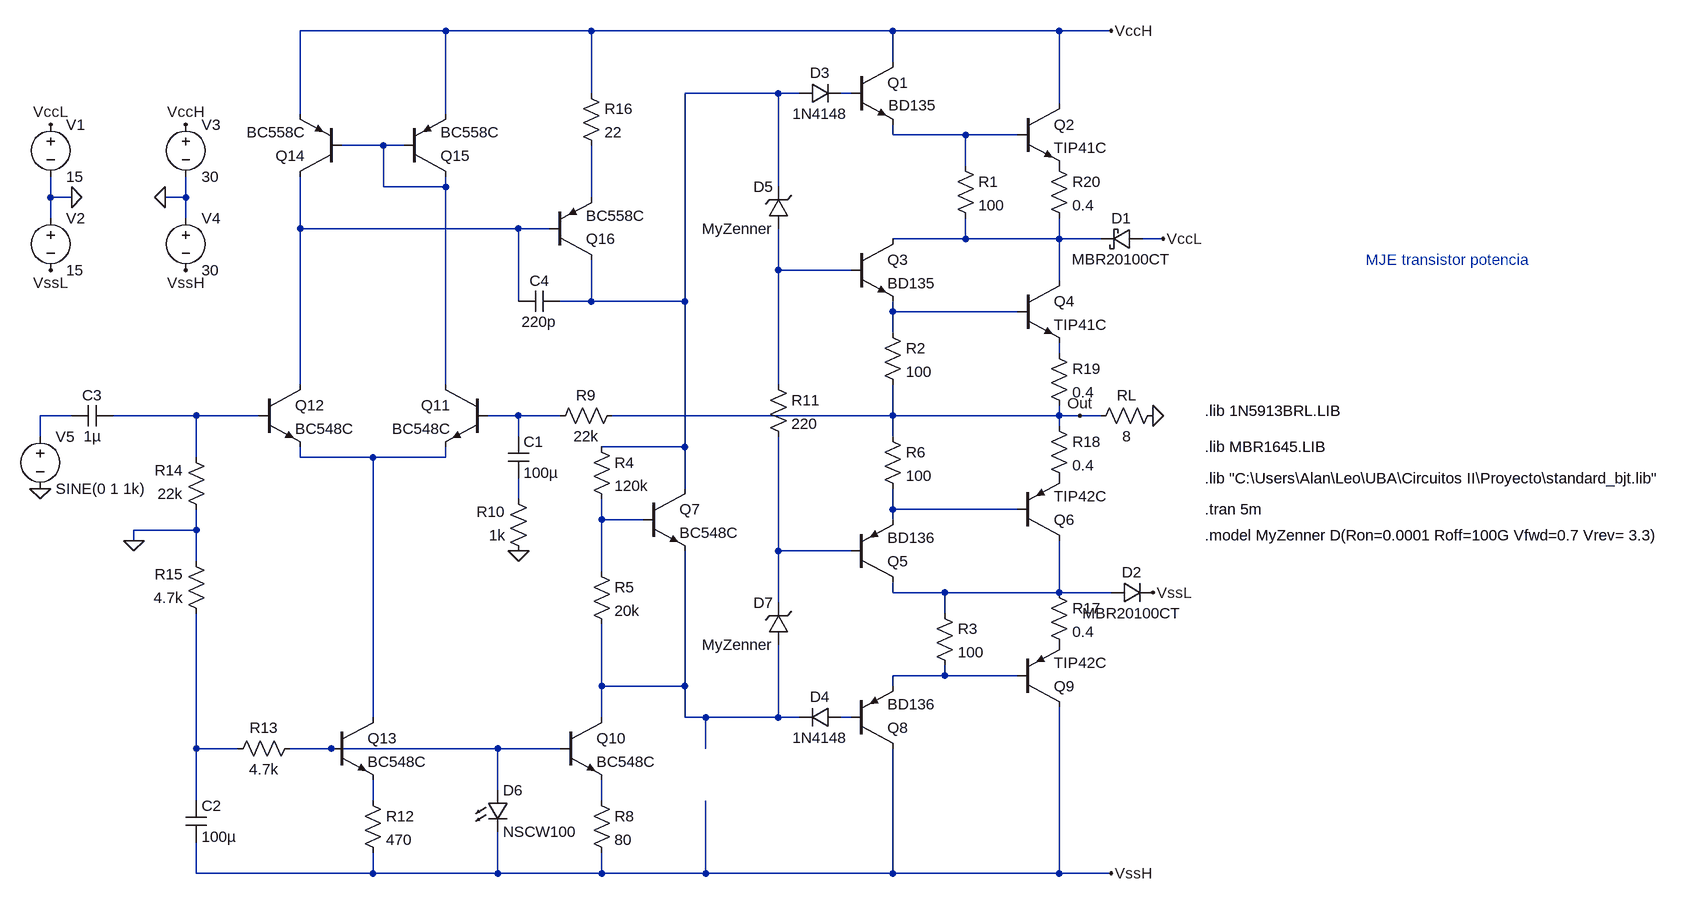
[diagram p0: schematic etapa_ampli (1).asc]
etapa_ampli (1).asc, the LTspice schematic file:
Version 4
SHEET 1 1736 1404
WIRE -512 48 -736 48
WIRE -288 48 -512 48
WIRE 176 48 -288 48
WIRE 432 48 176 48
WIRE 512 48 432 48
WIRE 176 96 176 48
WIRE -288 144 -288 48
WIRE 0 144 -144 144
WIRE 32 144 0 144
WIRE 112 144 96 144
WIRE 432 160 432 48
WIRE -736 176 -736 48
WIRE -512 176 -512 48
WIRE 176 208 176 192
WIRE 288 208 176 208
WIRE 368 208 288 208
WIRE -608 224 -672 224
WIRE -576 224 -608 224
WIRE 288 256 288 208
WIRE -608 288 -608 224
WIRE -512 288 -512 272
WIRE -512 288 -608 288
WIRE 0 288 0 144
WIRE -1120 304 -1120 272
WIRE -1088 304 -1120 304
WIRE -912 304 -912 272
WIRE -912 304 -944 304
WIRE -288 304 -288 224
WIRE -1120 336 -1120 304
WIRE -912 336 -912 304
WIRE -736 352 -736 272
WIRE -400 352 -736 352
WIRE -352 352 -400 352
WIRE 288 368 288 336
WIRE 288 368 176 368
WIRE 432 368 432 336
WIRE 432 368 288 368
WIRE 496 368 432 368
WIRE 592 368 560 368
WIRE 0 416 0 352
WIRE 112 416 0 416
WIRE 432 432 432 368
WIRE -400 464 -400 352
WIRE -288 464 -288 400
WIRE -288 464 -336 464
WIRE -144 464 -144 144
WIRE -144 464 -288 464
WIRE 176 480 176 464
WIRE 368 480 176 480
WIRE 176 512 176 480
WIRE 432 544 432 528
WIRE -736 592 -736 352
WIRE -512 592 -512 288
WIRE 0 592 0 416
WIRE -1088 640 -1136 640
WIRE -896 640 -1024 640
WIRE -800 640 -896 640
WIRE -400 640 -448 640
WIRE -336 640 -400 640
WIRE 176 640 176 592
WIRE 176 640 -256 640
WIRE 432 640 432 624
WIRE 432 640 176 640
WIRE 464 640 432 640
WIRE 496 640 464 640
WIRE 432 656 432 640
WIRE -1136 672 -1136 640
WIRE -400 672 -400 640
WIRE 176 672 176 640
WIRE -144 688 -144 464
WIRE -144 688 -272 688
WIRE -896 704 -896 640
WIRE -736 704 -736 688
WIRE -624 704 -736 704
WIRE -512 704 -512 688
WIRE -512 704 -624 704
WIRE -144 752 -144 688
WIRE -400 768 -400 736
WIRE 176 784 176 752
WIRE 368 784 176 784
WIRE -272 800 -272 768
WIRE -208 800 -272 800
WIRE 176 800 176 784
WIRE -896 816 -896 784
WIRE -896 816 -992 816
WIRE -992 832 -992 816
WIRE 0 848 0 672
WIRE 112 848 0 848
WIRE -896 864 -896 816
WIRE -272 880 -272 800
WIRE 176 912 176 896
WIRE 256 912 176 912
WIRE 432 912 432 832
WIRE 432 912 256 912
WIRE 512 912 432 912
WIRE 0 928 0 848
WIRE 256 944 256 912
WIRE 256 1040 256 1024
WIRE 256 1040 176 1040
WIRE 368 1040 256 1040
WIRE -272 1056 -272 960
WIRE -144 1056 -144 848
WIRE -144 1056 -272 1056
WIRE 176 1056 176 1040
WIRE -624 1104 -624 704
WIRE -272 1104 -272 1056
WIRE -144 1104 -144 1056
WIRE -112 1104 -144 1104
WIRE 0 1104 0 992
WIRE 0 1104 -112 1104
WIRE 32 1104 0 1104
WIRE 112 1104 96 1104
WIRE -896 1152 -896 944
WIRE -832 1152 -896 1152
WIRE -688 1152 -752 1152
WIRE -432 1152 -688 1152
WIRE -336 1152 -432 1152
WIRE -112 1152 -112 1104
WIRE -432 1216 -432 1152
WIRE -896 1232 -896 1152
WIRE -624 1232 -624 1200
WIRE -272 1232 -272 1200
WIRE -896 1344 -896 1296
WIRE -624 1344 -624 1312
WIRE -624 1344 -896 1344
WIRE -432 1344 -432 1280
WIRE -432 1344 -624 1344
WIRE -272 1344 -272 1312
WIRE -272 1344 -432 1344
WIRE -112 1344 -112 1232
WIRE -112 1344 -272 1344
WIRE 176 1344 176 1152
WIRE 176 1344 -112 1344
WIRE 432 1344 432 1088
WIRE 432 1344 176 1344
WIRE 512 1344 432 1344
FLAG 592 368 VccL
FLAG 512 48 VccH
FLAG 576 640 0
FLAG 512 1344 VssH
FLAG 576 912 VssL
FLAG -1088 304 0
FLAG -944 304 0
FLAG -912 192 VccH
FLAG -1120 192 VccL
FLAG -912 416 VssH
FLAG -1120 416 VssL
FLAG 464 640 Out
FLAG -400 848 0
FLAG -992 832 0
FLAG -1136 752 0
DATAFLAG 288 640 ""
DATAFLAG 320 784 ""
DATAFLAG 288 480 ""
DATAFLAG -144 688 "$-V(N021)"
SYMBOL npn 112 96 R0
WINDOW 3 57 66 Left 2
SYMATTR Value BD135
SYMATTR InstName Q1
SYMBOL npn 368 160 R0
SYMATTR InstName Q2
SYMATTR Value TIP41C
SYMBOL npn 112 368 R0
SYMATTR InstName Q3
SYMATTR Value BD135
SYMBOL npn 368 432 R0
SYMATTR InstName Q4
SYMATTR Value TIP41C
SYMBOL res 272 240 R0
SYMATTR InstName R1
SYMATTR Value 100
SYMBOL res 480 656 R270
WINDOW 0 32 56 VTop 2
WINDOW 3 0 56 VBottom 2
SYMATTR InstName RL
SYMATTR Value 8
SYMBOL pnp 112 896 M180
SYMATTR InstName Q5
SYMATTR Value BD136
SYMBOL pnp 368 832 M180
SYMATTR InstName Q6
SYMATTR Value TIP42C
SYMBOL pnp 368 1088 M180
SYMATTR InstName Q9
SYMATTR Value TIP42C
SYMBOL pnp 112 1152 M180
SYMATTR InstName Q8
SYMATTR Value BD136
SYMBOL res 240 928 R0
SYMATTR InstName R3
SYMATTR Value 100
SYMBOL voltage -1120 176 R0
WINDOW 123 0 0 Left 0
WINDOW 39 0 0 Left 0
SYMATTR InstName V1
SYMATTR Value 15
SYMBOL voltage -1120 320 R0
WINDOW 123 0 0 Left 0
WINDOW 39 0 0 Left 0
SYMATTR InstName V2
SYMATTR Value 15
SYMBOL voltage -912 176 R0
WINDOW 123 0 0 Left 0
WINDOW 39 0 0 Left 0
SYMATTR InstName V3
SYMATTR Value 30
SYMBOL voltage -912 320 R0
WINDOW 123 0 0 Left 0
WINDOW 39 0 0 Left 0
SYMATTR InstName V4
SYMATTR Value 30
SYMBOL diode 32 160 R270
WINDOW 0 32 32 VTop 2
WINDOW 3 0 32 VBottom 2
SYMATTR InstName D3
SYMATTR Value 1N4148
SYMBOL diode 96 1088 R90
WINDOW 0 0 32 VBottom 2
WINDOW 3 32 32 VTop 2
SYMATTR InstName D4
SYMATTR Value 1N4148
SYMBOL res 160 496 R0
SYMATTR InstName R2
SYMATTR Value 100
SYMBOL res 160 656 R0
SYMATTR InstName R6
SYMATTR Value 100
SYMBOL npn -208 752 R0
SYMATTR InstName Q7
SYMATTR Value BC548C
SYMBOL res -288 672 R0
SYMATTR InstName R4
SYMATTR Value 120k
SYMBOL res -288 864 R0
SYMATTR InstName R5
SYMATTR Value 20k
SYMBOL npn -336 1104 R0
SYMATTR InstName Q10
SYMATTR Value BC548C
SYMBOL res -288 1216 R0
SYMATTR InstName R8
SYMATTR Value 80
SYMBOL npn -448 592 M0
SYMATTR InstName Q11
SYMATTR Value BC548C
SYMBOL res -240 624 R90
WINDOW 0 0 56 VBottom 2
WINDOW 3 32 56 VTop 2
SYMATTR InstName R9
SYMATTR Value 22k
SYMBOL res -384 864 R180
WINDOW 0 36 76 Left 2
WINDOW 3 36 40 Left 2
SYMATTR InstName R10
SYMATTR Value 1k
SYMBOL cap -416 672 R0
SYMATTR InstName C1
SYMATTR Value 100µ
SYMBOL res -16 576 R0
SYMATTR InstName R11
SYMATTR Value 220
SYMBOL npn -800 592 R0
SYMATTR InstName Q12
SYMATTR Value BC548C
SYMBOL npn -688 1104 R0
SYMATTR InstName Q13
SYMATTR Value BC548C
SYMBOL res -640 1216 R0
SYMATTR InstName R12
SYMATTR Value 470
SYMBOL res -736 1136 R90
WINDOW 0 0 56 VBottom 2
WINDOW 3 32 56 VTop 2
SYMATTR InstName R13
SYMATTR Value 4.7k
SYMBOL res -880 800 R180
WINDOW 0 36 76 Left 2
WINDOW 3 36 40 Left 2
SYMATTR InstName R14
SYMATTR Value 22k
SYMBOL res -880 960 R180
WINDOW 0 36 76 Left 2
WINDOW 3 36 40 Left 2
SYMATTR InstName R15
SYMATTR Value 4.7k
SYMBOL cap -912 1232 R0
SYMATTR InstName C2
SYMATTR Value 100µ
SYMBOL cap -1024 624 R90
WINDOW 0 0 32 VBottom 2
WINDOW 3 32 32 VTop 2
SYMATTR InstName C3
SYMATTR Value 1µ
SYMBOL voltage -1136 656 R0
WINDOW 123 24 124 Left 2
WINDOW 39 0 0 Left 0
SYMATTR InstName V5
SYMATTR Value SINE(0 1 1k)
SYMBOL pnp -672 272 R180
SYMATTR InstName Q14
SYMATTR Value BC558C
SYMBOL pnp -576 272 M180
SYMATTR InstName Q15
SYMATTR Value BC558C
SYMBOL res -304 128 R0
SYMATTR InstName R16
SYMATTR Value 22
SYMBOL pnp -352 400 M180
SYMATTR InstName Q16
SYMATTR Value BC558C
SYMBOL cap -336 448 R90
WINDOW 0 0 32 VBottom 2
WINDOW 3 32 32 VTop 2
SYMATTR InstName C4
SYMATTR Value 220p
SYMBOL res 416 896 R0
SYMATTR InstName R17
SYMATTR Value 0.4
SYMBOL res 416 640 R0
SYMATTR InstName R18
SYMATTR Value 0.4
SYMBOL res 416 528 R0
SYMATTR InstName R19
SYMATTR Value 0.4
SYMBOL res 416 240 R0
SYMATTR InstName R20
SYMATTR Value 0.4
SYMBOL zener 16 992 R180
WINDOW 0 24 64 Left 2
WINDOW 3 24 0 Left 2
SYMATTR InstName D7
SYMATTR Value MyZenner
SYMBOL zener 16 352 R180
WINDOW 0 24 64 Left 2
WINDOW 3 24 0 Left 2
SYMATTR InstName D5
SYMATTR Value MyZenner
SYMBOL schottky 560 352 R90
WINDOW 0 0 32 VBottom 2
WINDOW 3 32 32 VTop 2
SYMATTR InstName D1
SYMATTR Value MBR20100CT
SYMATTR Description Diode
SYMATTR Type diode
SYMBOL diode 512 928 R270
WINDOW 0 32 32 VTop 2
WINDOW 3 0 32 VBottom 2
SYMATTR InstName D2
SYMATTR Value MBR20100CT
SYMBOL LED -448 1216 R0
SYMATTR InstName D6
SYMATTR Value NSCW100
TEXT 656 736 Left 2 !.lib "C:\\Users\\Alan\\Leo\\UBA\\Circuitos II\\Proyecto\\standard_bjt.lib"
TEXT 656 784 Left 2 !.tran 5m
TEXT 656 688 Left 2 !.lib MBR1645.LIB
TEXT 656 632 Left 2 !.lib 1N5913BRL.LIB
TEXT 656 824 Left 2 !.model MyZenner D(Ron=0.0001 Roff=100G Vfwd=0.7 Vrev= 3.3)
TEXT 904 400 Left 2 ;MJE transistor potencia

The netlist it stands for:
* etapa_ampli (1).asc
Q1 VccH N002 N003 0 BD135
Q2 VccH N003 P001 0 TIP41C
Q3 N007 N008 N009 0 BD135
Q4 N007 N009 N010 0 TIP41C
R1 N003 N007 100
RL Out 0 8
Q5 N019 N018 N016 0 BD136
Q6 N019 N016 P002 0 TIP42C
Q9 VssH N020 P003 0 TIP42C
Q8 VssH N022 N020 0 BD136
R3 N019 N020 100
V1 VccL 0 15
V2 0 VssL 15
V3 VccH 0 30
V4 0 VssH 30
D3 N001 N002 1N4148
D4 N022 N021 1N4148
R2 N009 Out 100
R6 Out N016 100
Q7 N001 N017 N021 0 BC548C
R4 N001 N017 120k
R5 N017 N021 20k
Q10 N021 N024 N026 0 BC548C
R8 N026 VssH 80
Q11 N004 N013 N014 0 BC548C
R9 Out N013 22k
R10 0 N015 1k
C1 N013 N015 100µ
R11 N008 N018 220
Q12 N006 N012 N014 0 BC548C
Q13 N014 N024 N025 0 BC548C
R12 N025 VssH 470
R13 N024 N023 4.7k
R14 0 N012 22k
R15 N023 0 4.7k
C2 N023 VssH 100µ
C3 N012 N011 1µ
V5 N011 0 SINE(0 1 1k)
Q14 N006 N004 VccH 0 BC558C
Q15 N004 N004 VccH 0 BC558C
R16 VccH N005 22
Q16 N001 N006 N005 0 BC558C
C4 N001 N006 220p
R17 N019 P003 0.4
R18 Out P002 0.4
R19 N010 Out 0.4
R20 P001 N007 0.4
D7 N021 N018 MyZenner
D5 N008 N001 MyZenner
D1 VccL N007 MBR20100CT
D2 N019 VssL MBR20100CT
D6 N024 VssH NSCW100
.model D D
.lib standard.dio
.model NPN NPN
.model PNP PNP
.lib standard.bjt
.lib "C:\Users\Alan\Leo\UBA\Circuitos II\Proyecto\standard_bjt.lib"
.tran 5m
.lib MBR1645.LIB
.lib 1N5913BRL.LIB
.model MyZenner D(Ron=0.0001 Roff=100G Vfwd=0.7 Vrev= 3.3)
* MJE transistor potencia
.backanno
.end